# EAGLE design SCH (EAGLE 9.6.2)
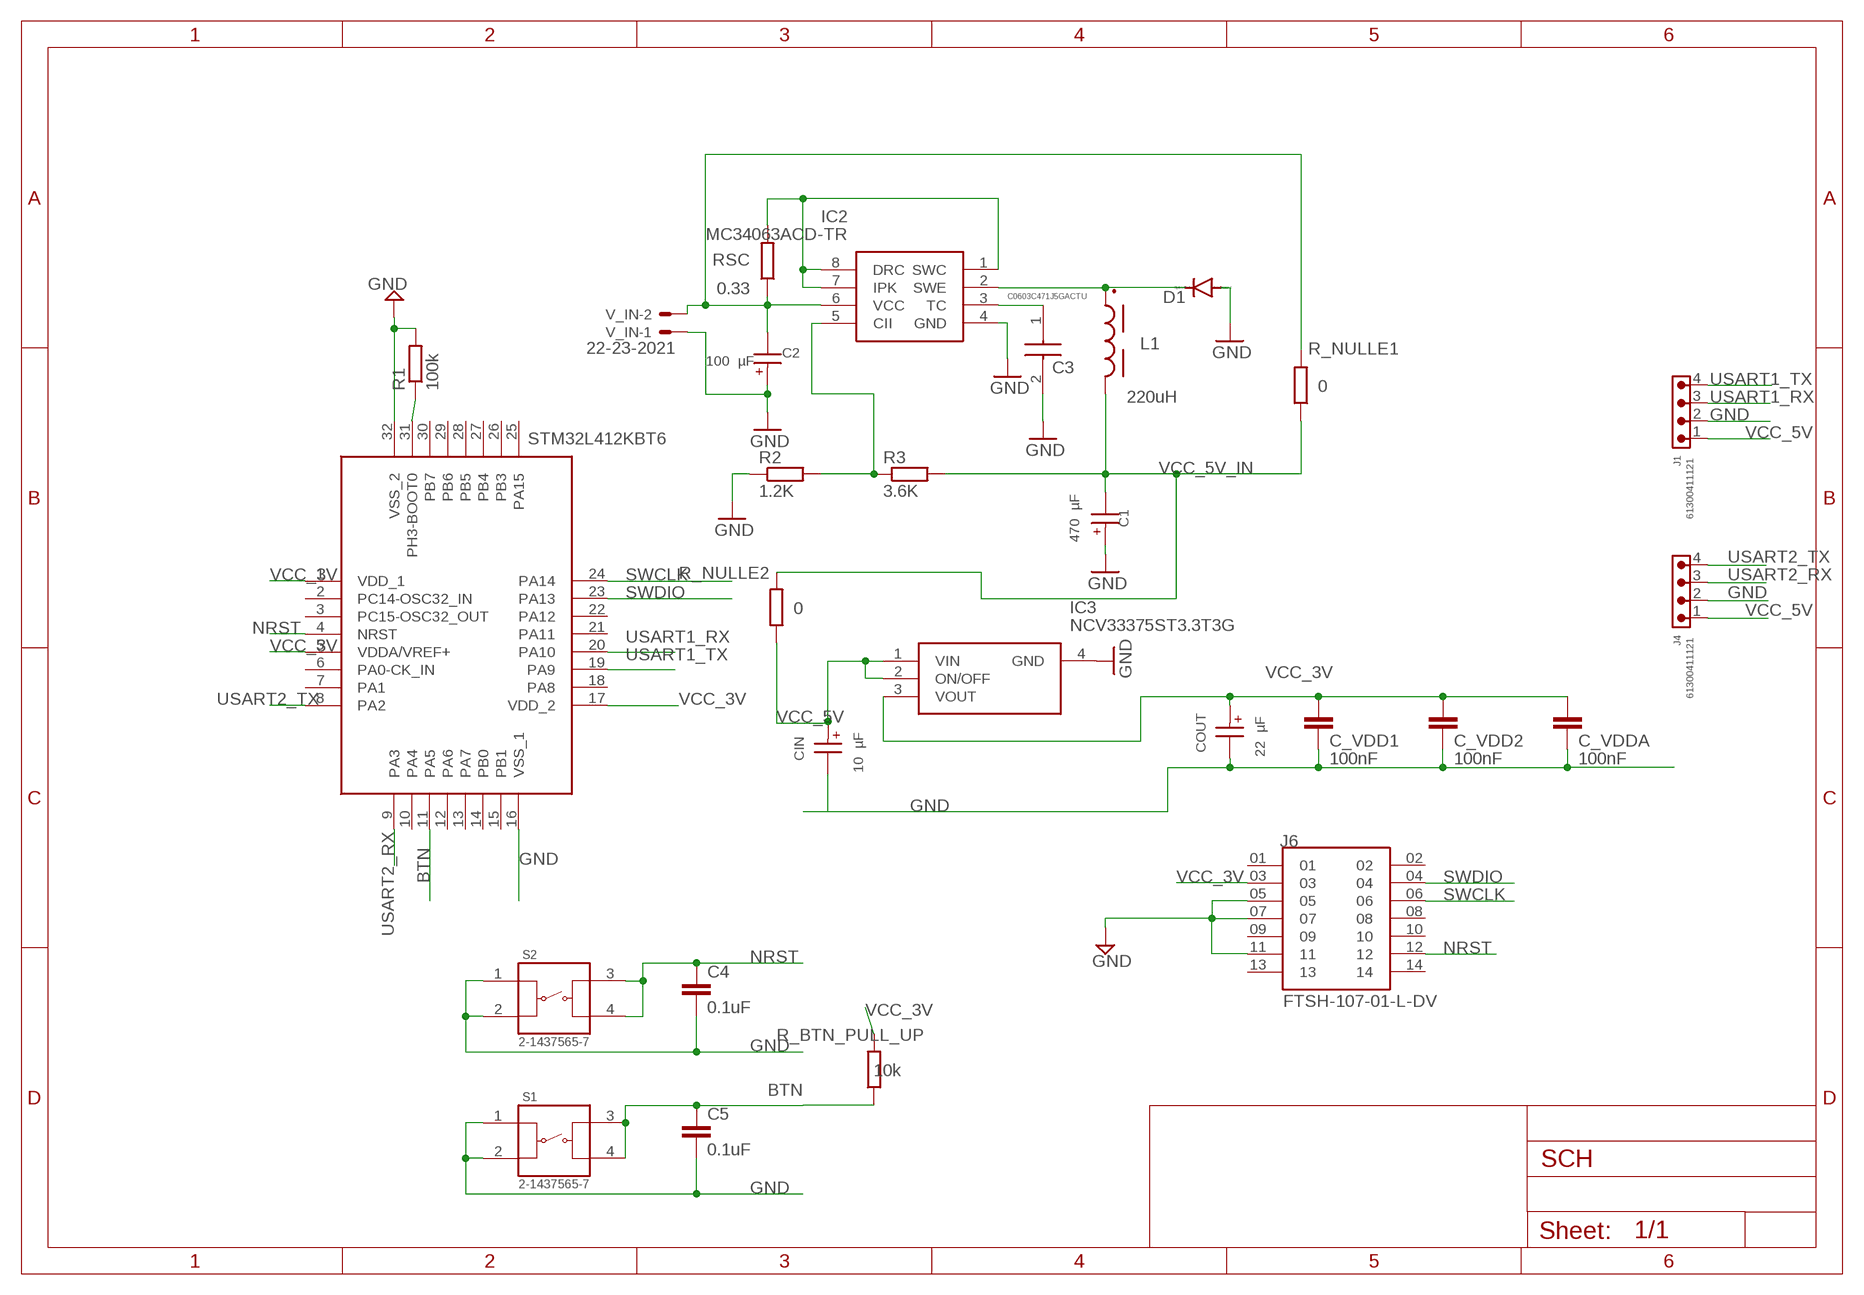
[diagram p0: schematic, sheet 1]

## Parts
C1  470 µF  WCAP-ASLL_8X10.5_865060353009  [WCAP-ASLL_8X10.5(DXL)]
C2  100 µF  WCAP-ASLL_6.3X7.7_865060445005  [WCAP-ASLL_6.3X7.7(DXL)]
C3  C0603C471J5GACTU  [C0603]
C4  0.1uF  C-EUC0603  [C0603]
C5  0.1uF  C-EUC0603  [C0603]
C_VDD1  100nF  C-EUC0603  [C0603]
C_VDD2  100nF  C-EUC0603  [C0603]
C_VDDA  100nF  C-EUC0603  [C0603]
CIN  10 µF  WCAP-ASLL_4X5.5_865060440001  [WCAP-ASLL_4X5.5(DXL)]
COUT  22 µF  WCAP-ASLL_5X5.5_865060442002  [WCAP-ASLL_5X5.5(DXL)]
D1  DIODE-DO214AC  [DO214AC]
IC1  STM32L412KBT6  [QFP80P900X900X160-32N]
IC2  MC34063ACD-TR  [SOIC127P600X175-8N]
IC3  NCV33375ST3.3T3G  [SOT230P700X175-4N]
J1  61300411121  6130XX11121_61300411121  [61300411121]
J4  61300411121  6130XX11121_61300411121  [61300411121]
J6  FTSH-107-01-L-DV  [SAMTEC_FTSH-107-01-L-DV]
L1  220uH  WE-PDA_1260_784771221  [WE-PDA_1260]
R1  100k  R-EU_R0603  [R0603]
R2  1.2K  R-EU_R0603  [R0603]
R3  3.6K  R-EU_R0603  [R0603]
R_BTN_PULL_UP  10k  R-EU_R0603  [R0603]
R_NULLE1  0  R-EU_R0603  [R0603]
R_NULLE2  0  R-EU_R0603  [R0603]
RSC  0.33  R-EU_R1206W  [R1206W]
S1  2-1437565-7  [SW_2-1437565-7]
S2  2-1437565-7  [SW_2-1437565-7]
V_IN  22-23-2021  [22-23-2021]

## Nets
BTN: C5.1 IC1.11(PA5) R_BTN_PULL_UP.1 S1.3 S1.4
GND: C1.1(+) C2.1(+) C3.2 C4.2 C5.2 C_VDD1.2 C_VDD2.2 C_VDDA.2 CIN.2(-) COUT.2(-) D1.A IC1.16(VSS_1) IC1.32(VSS_2) IC2.4(GND) IC3.4(GND) J1.2 J4.2 J6.05 J6.07 J6.11 R1.2 R2.1 S1.1 S1.2 S2.1 S2.2 V_IN.1
N$1: IC1.31(PH3-BOOT0) R1.1
N$2: IC2.1(SWC) IC2.7(IPK) IC2.8(DRC) RSC.2
N$3: IC2.5(CII) R2.2 R3.1
N$5: C3.1 IC2.3(TC)
N$6: D1.C IC2.2(SWE) L1.1
NRST: C4.1 IC1.4(NRST) J6.12 S2.3 S2.4
SWCLK: IC1.24(PA14) J6.06
SWDIO: IC1.23(PA13) J6.04
USART1_RX: IC1.20(PA10) J1.3
USART1_TX: IC1.19(PA9) J1.4
USART2_RX: IC1.9(PA3) J4.3
USART2_TX: IC1.8(PA2) J4.4
VCC_3V: C_VDD1.1 C_VDD2.1 C_VDDA.1 COUT.1(+) IC1.1(VDD_1) IC1.5(VDDA/VREF+) IC1.17(VDD_2) IC3.3(VOUT) J6.03 R_BTN_PULL_UP.2
VCC_5V: CIN.1(+) IC3.1(VIN) IC3.2(ON/OFF) J1.1 J4.1 R_NULLE2.1
VCC_5V_IN: C1.2(-) L1.2 R3.2 R_NULLE1.1 R_NULLE2.2
VCC_6V: C2.2(-) IC2.6(VCC) R_NULLE1.2 RSC.1 V_IN.2
Unconnected: IC1.2(PC14-OSC32_IN) IC1.3(PC15-OSC32_OUT) IC1.6(PA0-CK_IN) IC1.7(PA1) IC1.10(PA4) IC1.12(PA6) IC1.13(PA7) IC1.14(PB0) IC1.15(PB1) IC1.18(PA8) IC1.21(PA11) IC1.22(PA12) IC1.25(PA15) IC1.26(PB3) IC1.27(PB4) IC1.28(PB5) IC1.29(PB6) IC1.30(PB7) J6.01 J6.02 J6.08 J6.09 J6.10 J6.13 J6.14

## Library data of the parts
C1 = C1:WCAP-ASLL_8X10.5: WCAP-ASLL Aluminium Electrolytic Capacitors Low Impedance & Long Life +105 °C Characteristics Low impedance and long life product series Mounting style: V-Chip SMT Capacitance range: 1 µF ‒ 6800 µF Capacitance tolerance: ±20 % Voltage range (UR): 6.3 ‒ 450 V(DC) Operating temperature: -55 °C up to +105 °C for UR ≤ 100 V(DC) -40 °C up to +105 °C for UR > 100 V(DC) Endurance: 2000 ‒ 5000 h @ +105 °C Dimensions (DxL) in mm: 4.0 x 5.5 up to 16.0 x 17.0 Recommended soldering: Reflow soldering Applications Long life application & low impedance Input and output capacitor for switched-mode power supply Filtering Smoothing e.g. DC/DC converter, AC/DC converter, satellite receiver, control panel <https://www.we-online.com/catalog/media/o14724v209%20Family_WCAP-ASLL.jpg> Details see: https://www.we-online.com/catalog/en/WCAP-ASLL/ Updated by yingchun,Shan;2020-03-03 2020(C) Würth Elektronik; DATASHEET-URL: https://www.we-online.com/catalog/datasheet/865060353009.pdf; DF: 16%; DIAMETER: 8mm; I-LEAK: 75.2uA; I-RIPPLE: 600mA; L: 10.5mm; OPERATING-TEMPERATURE: -55 °C up to +105 °C; PART-NUMBER: 865060353009; TECHNICAL-REFERENCE: ASEE105471M016DVCTEE000; VR: 16V(DC); Z: 0.17Ohm
C2 = C2:WCAP-ASLL_6.3X7.7: WCAP-ASLL Aluminium Electrolytic Capacitors Low Impedance & Long Life +105 °C Characteristics Low impedance and long life product series Mounting style: V-Chip SMT Capacitance range: 1 µF ‒ 6800 µF Capacitance tolerance: ±20 % Voltage range (UR): 6.3 ‒ 450 V(DC) Operating temperature: -55 °C up to +105 °C for UR ≤ 100 V(DC) -40 °C up to +105 °C for UR > 100 V(DC) Endurance: 2000 ‒ 5000 h @ +105 °C Dimensions (DxL) in mm: 4.0 x 5.5 up to 16.0 x 17.0 Recommended soldering: Reflow soldering Applications Long life application & low impedance Input and output capacitor for switched-mode power supply Filtering Smoothing e.g. DC/DC converter, AC/DC converter, satellite receiver, control panel <https://www.we-online.com/catalog/media/o14724v209%20Family_WCAP-ASLL.jpg> Details see: https://www.we-online.com/catalog/en/WCAP-ASLL/ Updated by yingchun,Shan;2020-03-03 2020(C) Würth Elektronik; DATASHEET-URL: https://www.we-online.com/catalog/datasheet/865060445005.pdf; DF: 14%; DIAMETER: 6.3mm; I-LEAK: 25uA; I-RIPPLE: 300mA; L: 7.7mm; OPERATING-TEMPERATURE: -55 °C up to +105 °C; PART-NUMBER: 865060445005; TECHNICAL-REFERENCE: ASED077101M025DVCTCB000; VR: 25V(DC); Z: 0.36Ohm
C3 = C3:C0603C471J5GACTU: SMD Comm C0G, Ceramic, 470 pF, 5%, 50 VDC, 125 VDC, 125?C, -55?C, C0G, SMD, MLCC, Ultra-Stable, Low Loss, Class I, 0.1 % , 100 GOhms, 3.7 mg, 0603, 1.6mm, 0.8mm, 0.8mm, 0.7mm, 0.35mm, 4000, 78 Weeks, 120 Source: Datasheet <https://content.kemet.com/datasheets/KEM_C1003_C0G_SMD.pdf>; ARROW_PART_NUMBER: C0603C471J5GACTU; ARROW_PRICE-STOCK: https://www.arrow.com/en/products/c0603c471j5gactu/kemet-corporation?region=nac; DESCRIPTION: SMD Comm C0G, Ceramic, 470 pF, 5%, 50 VDC, 125 VDC, 125?C, -55?C, C0G, SMD, MLCC, Ultra-Stable, Low Loss, Class I, 0.1 % , 100 GOhms, 3.7 mg, 0603, 1.6mm, 0.8mm, 0.8mm, 0.7mm, 0.35mm, 4000, 78 Weeks, 120; HEIGHT: 0.87mm; MANUFACTURER_NAME: KEMET; MANUFACTURER_PART_NUMBER: C0603C471J5GACTU; MOUSER_PART_NUMBER: 80-C0603C471J5G; MOUSER_PRICE-STOCK: https://www.mouser.co.uk/ProductDetail/KEMET/C0603C471J5GACTU?qs=6Zy9Yzz7FWCvDjERNKhvPg%3D%3D
C4 C5 C_VDD1 C_VDD2 C_VDDA = rcl:C-EU: CAPACITOR, European symbol; SPICEPREFIX: C
CIN = Cin:WCAP-ASLL_4X5.5: WCAP-ASLL Aluminium Electrolytic Capacitors Low Impedance & Long Life +105 °C Characteristics Low impedance and long life product series Mounting style: V-Chip SMT Capacitance range: 1 µF ‒ 6800 µF Capacitance tolerance: ±20 % Voltage range (UR): 6.3 ‒ 450 V(DC) Operating temperature: -55 °C up to +105 °C for UR ≤ 100 V(DC) -40 °C up to +105 °C for UR > 100 V(DC) Endurance: 2000 ‒ 5000 h @ +105 °C Dimensions (DxL) in mm: 4.0 x 5.5 up to 16.0 x 17.0 Recommended soldering: Reflow soldering Applications Long life application & low impedance Input and output capacitor for switched-mode power supply Filtering Smoothing e.g. DC/DC converter, AC/DC converter, satellite receiver, control panel <https://www.we-online.com/catalog/media/o14724v209%20Family_WCAP-ASLL.jpg> Details see: https://www.we-online.com/catalog/en/WCAP-ASLL/ Updated by yingchun,Shan;2020-03-03 2020(C) Würth Elektronik; DATASHEET-URL: https://www.we-online.com/catalog/datasheet/865060440001.pdf; DF: 14%; DIAMETER: 4mm; I-LEAK: 3uA; I-RIPPLE: 90mA; L: 5.5mm; OPERATING-TEMPERATURE: -55 °C up to +105 °C; PART-NUMBER: 865060440001; TECHNICAL-REFERENCE: ASEB055100M025DVCTAB000; VR: 25V(DC); Z: 1.35Ohm
COUT = Cout:WCAP-ASLL_5X5.5: WCAP-ASLL Aluminium Electrolytic Capacitors Low Impedance & Long Life +105 °C Characteristics Low impedance and long life product series Mounting style: V-Chip SMT Capacitance range: 1 µF ‒ 6800 µF Capacitance tolerance: ±20 % Voltage range (UR): 6.3 ‒ 450 V(DC) Operating temperature: -55 °C up to +105 °C for UR ≤ 100 V(DC) -40 °C up to +105 °C for UR > 100 V(DC) Endurance: 2000 ‒ 5000 h @ +105 °C Dimensions (DxL) in mm: 4.0 x 5.5 up to 16.0 x 17.0 Recommended soldering: Reflow soldering Applications Long life application & low impedance Input and output capacitor for switched-mode power supply Filtering Smoothing e.g. DC/DC converter, AC/DC converter, satellite receiver, control panel <https://www.we-online.com/catalog/media/o14724v209%20Family_WCAP-ASLL.jpg> Details see: https://www.we-online.com/catalog/en/WCAP-ASLL/ Updated by yingchun,Shan;2020-03-03 2020(C) Würth Elektronik; DATASHEET-URL: https://www.we-online.com/catalog/datasheet/865060442002.pdf; DF: 14%; DIAMETER: 5mm; I-LEAK: 5.5uA; I-RIPPLE: 150mA; L: 5.5mm; OPERATING-TEMPERATURE: -55 °C up to +105 °C; PART-NUMBER: 865060442002; TECHNICAL-REFERENCE: ASEC055220M025DVCTBB000; VR: 25V(DC); Z: 0.8Ohm
D1 = diode:DIODE-: DIODE
IC1 = STM32_librairy:STM32L412KBT6: ARM Microcontrollers - MCU Ultra-low-power Arm Cortex -M4 32-bit MCU+FPU, 100DMIPS up to 128KB Flash, 40KB SRAM, analog, ext. SMPS Source: Datasheet; DESCRIPTION: ARM Microcontrollers - MCU Ultra-low-power Arm Cortex -M4 32-bit MCU+FPU, 100DMIPS up to 128KB Flash, 40KB SRAM, analog, ext. SMPS; HEIGHT: 1.6mm; MANUFACTURER_NAME: STMicroelectronics; MANUFACTURER_PART_NUMBER: STM32L412KBT6; MOUSER_PART_NUMBER: 511-STM32L412KBT6; MOUSER_PRICE-STOCK: https://www.mouser.co.uk/ProductDetail/STMicroelectronics/STM32L412KBT6?qs=%252BEew9%252B0nqrD6o08jV%2F00TA%3D%3D
IC2 = SamacSys_Parts:MC34063ACD-TR: MC34063ACD-TR, DC-DC Controller, 40 V, 8-Pin, SOIC Source: Datasheet <http://www.st.com/st-web-ui/static/active/en/resource/technical/document/datasheet/CD00001232.pdf>; DESCRIPTION: MC34063ACD-TR, DC-DC Controller, 40 V, 8-Pin, SOIC; HEIGHT: 1.75mm; MANUFACTURER_NAME: STMicroelectronics; MANUFACTURER_PART_NUMBER: MC34063ACD-TR; MOUSER_PART_NUMBER: 511-MC34063ACD-TR; MOUSER_PRICE-STOCK: https://www.mouser.co.uk/ProductDetail/STMicroelectronics/MC34063ACD-TR?qs=zDcCjb1ShEnlEhOFqqejBw%3D%3D
IC3 = SamacSys_Parts:NCV33375ST3.3T3G: ON SEMICONDUCTOR - NCV33375ST3.3T3G - Fixed LDO Voltage Regulator, 4.3V to 13V, 260mV Dropout, 3.3Vout, 300mAout, SOT-223-4 Source: Datasheet <http://www.onsemi.com/pub/Collateral/MC33375-D.PDF>; DESCRIPTION: ON SEMICONDUCTOR - NCV33375ST3.3T3G - Fixed LDO Voltage Regulator, 4.3V to 13V, 260mV Dropout, 3.3Vout, 300mAout, SOT-223-4; HEIGHT: 1.75mm; MANUFACTURER_NAME: onsemi; MANUFACTURER_PART_NUMBER: NCV33375ST3.3T3G; MOUSER_PART_NUMBER: 863-NCV33375ST3.3T3G; MOUSER_PRICE-STOCK: https://www.mouser.co.uk/ProductDetail/ON-Semiconductor/NCV33375ST33T3G?qs=Pqj8oIac8rWOl%252BM3OwXrOg%3D%3D
J1 J4 = Eagle_WR-PHD (rev21a):6130XX11121_61300411121: WR-PHD 2.54 mm THT Pin Header ARTICLE PROPERTIES: Pins:1;​ 2;​ 3;​ 4;​ 5;​ 6;​ 7;​ 8;​ 9;​ 10;​ 12;​ 13;​ 14;​ 15;​ 16;​ 18;​ 20;​ 22;​ 24;​ 25;​ 32;​ 36;​ 40 KIND PROPERTIES: Pitch：2.54 mm Quality Class:3 as per CECC 75 301-802 Rows：Single Gender：Pin Header Type：Straight MATERIAL PROPERTIES: Insulator Material :PBT Insulator Flammability Rating:UL94 V-0 Contact Material:Copper Alloy Contact Plating:Gold Contact Type:Stamped GENERAL INFORMATION Operating Temperature:-40 up to +105 °C Compliance:RoHS ELECTRICAL PROPERTIES: Rated Current:3 A IR 1:3 A Withstanding Voltage:500 V (AC) Contact Resistance:20 mΩ RISO:1000 MΩ CERTIFICATION UL Approval:E323964 PACKAGING PROPERTIES Packaging:Bag <https://katalog.we-online.com/media/images/v2/o33211v209%20Family_BTB_PHD_6130xx11121.jpg> Details see: https://katalog.we-online.com/en/em/PHD_2_54_THT_PIN_HEADER_6130XX11121 Updated by Yingchun,Shan 2019-10-16 2019 (C) Würth Elektronik; DATASHEET-URL: https://www.we-online.com/catalog/datasheet/61300411121.pdf; GENDER: Pin Header; IR: 3A; MOUNT: THT; PACKAGING: Bag; PART-NUMBER: 61300411121; PINS: 4; PITCH: 2.54mm; ROWS: Single; TYPE: Straight
J6 = FTSH-107-01-L-DV:FTSH-107-01-L-DV; MANUFACTURER: Samtec; PARTREV: R; STANDARD: Manufacturer Recommendations
L1 = L:WE-PDA_1260: WE-PDA SMD Shielded Power Inductor Characteristics Magnetically shielded version which results in a low leakage field High storage capacity High Saturation currents up to 23 A Very low self-losses at high switching frequency's Wide inductance spectrum available at all sizes Operating Temperature -40 °C up to +125 °C Core Material: NiZn Wire connection: welding technology Applications Multimedia applications Switching regulators with low operating voltages Integrated DC/DC-converter Perfect suitable for switching regulators with extremely high efficiency (> 86 %) Plastic base: Because of the one piece construction these are more suitable for high vibration or shock applications <https://www.we-online.com/catalog/media/o55118v209%20Family_WE-PDA.jpg> Details see: https://www.we-online.com/katalog/en/WE-PDA Updated by Ella Wu 2020-03-18 2020(C) Wurth Elektronik; DATASHEET-URL: https://www.we-online.com/catalog/datasheet/784771221.pdf; FRES: 3.9MHz; IR: 0.99A; ISAT: 1.1A; MOUNT: SMT; PART-NUMBER: 784771221; RDC-MAX: 348mOhm; RDC-TYP: 290mOhm
R1-R3 R_BTN_PULL_UP R_NULLE1 R_NULLE2 RSC = rcl:R-EU_: RESISTOR, European symbol; SPICEPREFIX: R
S1 S2 = 2-1437565-7:2-1437565-7: FSM2JSMA=SMT,TACTILE,PB SWITCH Check availability <https://pricing.snapeda.com/parts/FSM2JSMA/TE%20Connectivity/view-part?ref=eda>; AVAILABILITY: In Stock; COMMENT: 2-1437565-7; CONFIGURATION_POLE-THROW: Single Pole - Single Throw; CONTACT_CURRENT_RATING: 50 mA; DESCRIPTION: Tactile Switch SPST-NO Top Actuated Surface Mount; MF: TE Connectivity; MP: FSM2JSMA; PACKAGE: None; PRICE: None; PURCHASE-URL: https://pricing.snapeda.com/search/part/FSM2JSMA/?ref=eda
V_IN = con-molex:22-23-2021: .100" (2.54mm) Center Header - 2 Pin; MF: MOLEX; MPN: 22-23-2021; OC_FARNELL: 1462926; OC_NEWARK: 25C3832

## Board
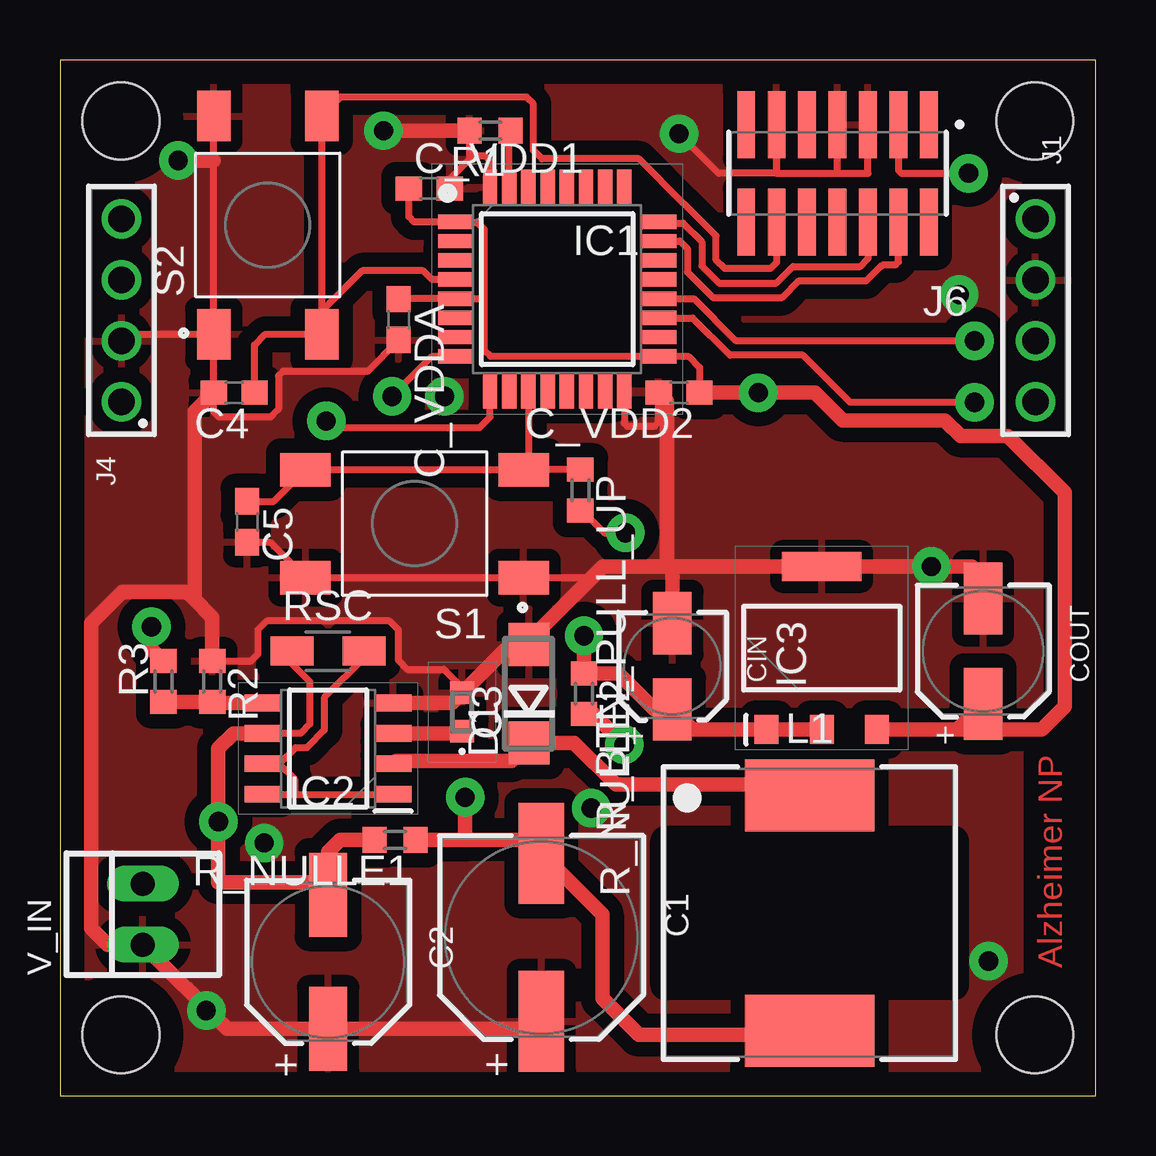
[diagram p1: board, top side]
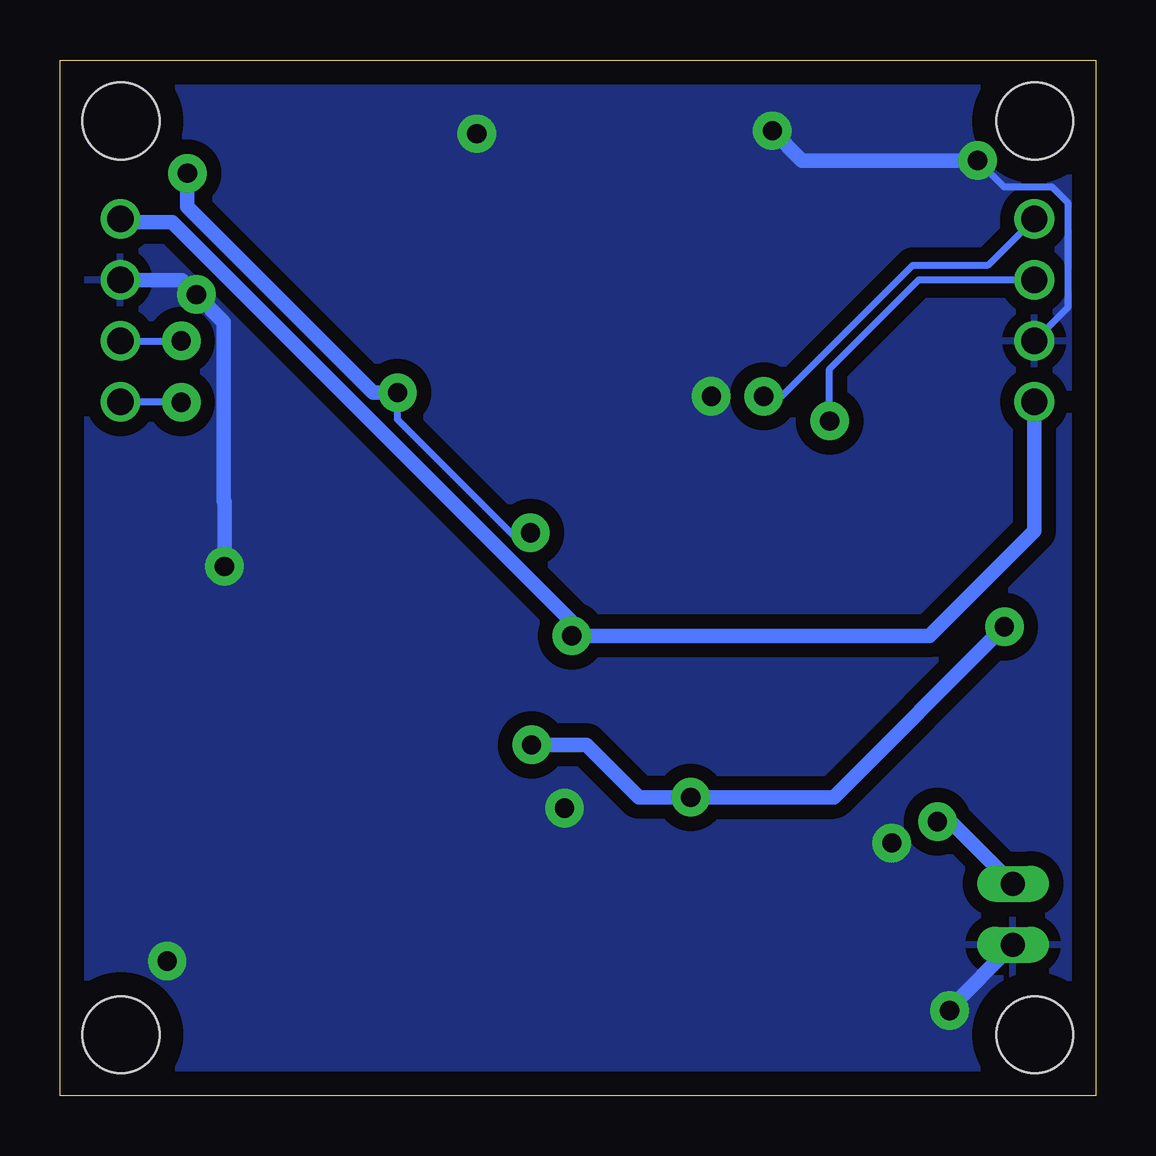
[diagram p2: board, bottom side, seen from below]

Size 43.18 x 43.18 mm. Coordinates in mm from the lower left corner, seen from the top.
Outline: 0,0 43.18,0 43.18,43.18 0,43.18 0,0
Copper layers (1*16): Top 0.035mm / dielectric 1.5mm / Bottom 0.035mm
Design rules "ENSEA_2022_04_08 *": minimum track width 0.3mm, minimum drill 0.5mm, track to track 0.3mm, track to pad 0.3mm, pad to pad 0.3mm, via to via 0.3mm, smd to smd 0.3mm, copper to edge 1mm, drill to drill 0.4mm, minimum pad ring 0.2mm, minimum via ring 0.2mm, stop-mask expansion 4mil, vias tented up to drill 0mil, thermal gap 0.5mm
Holes 3.2 mm at 2.54,2.54 40.64,2.54 40.64,40.64 2.54,40.64

### Footprints (pad centres in the part's own frame; a part is rotated, then mirrored left to right if it is on the bottom)
WCAP-ASLL_8X10.5(DXL) = smd 4.2 x 1.9: 1 3.5,0; 2 -3.5,0
WCAP-ASLL_6.3X7.7(DXL) = smd 3.5 x 1.6: 1 2.8,0; 2 -2.8,0
C0603 = smd 0.95 x 1: 1 -0.8,0; 2 0.8,0
C0603' = smd 1.1 x 1: 1 -0.85,0; 2 0.85,0
WCAP-ASLL_4X5.5(DXL) = smd 2.6 x 1.6: 1 1.8,0; 2 -1.8,0
WCAP-ASLL_5X5.5(DXL) = smd 3 x 1.6: 1 2.2,0; 2 -2.2,0
DO214AC = smd 1.8 x 1.7: A 2.05,0; C -2.05,0
QFP80P900X900X160-32N = smd 1.475 x 0.6: 1 -4.238,2.8; 2 -4.238,2; 3 -4.238,1.2; 4 -4.238,0.4; 5 -4.238,-0.4; 6 -4.238,-1.2; 7 -4.238,-2; 8 -4.238,-2.8; 17 4.238,-2.8; 18 4.238,-2; 19 4.238,-1.2; 20 4.238,-0.4; 21 4.238,0.4; 22 4.238,1.2; 23 4.238,2; 24 4.238,2.8 | smd 0.6 x 1.475: 9 -2.8,-4.238; 10 -2,-4.238; 11 -1.2,-4.238; 12 -0.4,-4.238; 13 0.4,-4.238; 14 1.2,-4.238; 15 2,-4.238; 16 2.8,-4.238; 25 2.8,4.238; 26 2,4.238; 27 1.2,4.238; 28 0.4,4.238; 29 -0.4,4.238; 30 -1.2,4.238; 31 -2,4.238; 32 -2.8,4.238
SOIC127P600X175-8N = smd 1.525 x 0.7: 1 -2.712,1.905; 2 -2.712,0.635; 3 -2.712,-0.635; 4 -2.712,-1.905; 5 2.712,-1.905; 6 2.712,-0.635; 7 2.712,0.635; 8 2.712,1.905
SOT230P700X175-4N = smd 1.2 x 1: 1 -3.4,2.3; 2 -3.4,0; 3 -3.4,-2.3 | smd 1.2 x 3.3: 4 3.4,0
61300411121 = drill 1.1: 1 -3.81,0; 2 -1.27,0; 3 1.27,0; 4 3.81,0
SAMTEC_FTSH-107-01-L-DV = smd 0.74 x 2.79: 01 -3.81,-2.035; 02 -3.81,2.035; 03 -2.54,-2.035; 04 -2.54,2.035; 05 -1.27,-2.035; 06 -1.27,2.035; 07 0,-2.035; 08 0,2.035; 09 1.27,-2.035; 10 1.27,2.035; 11 2.54,-2.035; 12 2.54,2.035; 13 3.81,-2.035; 14 3.81,2.035
WE-PDA_1260 = smd 5.4 x 3: 1 0,4.9; 2 0,-4.9
R0603 = smd 1 x 1.1: 1 -0.85,0; 2 0.85,0
R1206W = smd 1.8 x 1.2: 1 -1.499,0; 2 1.499,0
SW_2-1437565-7 = smd 2.1 x 1.4: 1 -4.55,2.25; 2 4.55,2.25; 3 -4.55,-2.25; 4 4.55,-2.25
22-23-2021 = drill 1 long: 1 -1.27,0; 2 1.27,0

### Placement (x,y rotation side)
C1  20.07,6.6 270 top
C2  11.18,5.59 270 top
C3  16.76,16 90 top
C4  0.1uF  [C0603']  7.26,29.31 180 top
C5  0.1uF  [C0603']  7.8,23.93 270 top
C_VDD1  100nF  [C0603']  15.39,37.82 0 top
C_VDD2  100nF  [C0603']  25.81,29.31 180 top
C_VDDA  100nF  [C0603']  14.12,32.36 270 top
CIN  25.53,17.91 270 top
COUT  38.48,18.54 270 top
D1  19.56,16.76 90 top
IC1  20.73,33.63 0 top
IC2  11.18,14.48 180 top
IC3  31.75,18.67 90 top
J1  40.67,32.74 270 top
J4  2.57,32.74 90 top
J6  32.41,38.46 180 top
L1  31.24,7.62 0 top
R1  17.93,40.23 180 top
R2  6.35,17.27 270 top
R3  4.32,17.27 90 top
R_BTN_PULL_UP  21.69,25.25 270 top
R_NULLE1  13.97,10.67 180 top
R_NULLE2  21.84,16.76 270 top
RSC  11.18,18.54 0 top
S1  14.78,23.85 180 top
S2  8.66,36.3 90 top
V_IN  3.45,7.57 90 top

### Tracks (layer width: path | path; a pad name or v marks a point on that pad's centre or on a via)
BTN
  Top 0.3: C5.1 8.91,24.78 S1.4 S1.3 | IC1.11 19.53,26.29 S1.3 | S1.3 R_BTN_PULL_UP.1
GND  (via drill 0.8 pad 1.6)
  Top 0.3: R2.1 7.96,18.12 8.26,18.41 8.26,19.43 8.64,19.81 13.72,19.81 14.1,19.43 14.1,18.16 14.48,17.78 16,17.78 16.76,17.02 C3.2 | S2.1 C4.2 6.41,28.51 6.63,28.3 8.79,28.3 9.11,28.62 9.11,30.02 9.3,30.2 12.81,30.2 C_VDDA.2 | J4.2 2.84,31.75 S2.1 | R1.2 17.08,39.04 | IC1.16 23.53,28.04 23.65,27.91 24.79,27.91 24.96,28.08 C_VDD2.2 | S2.1 6.41,38.99 S2.2 | J6.11 29.87,38.46 | 29.87,38.46 32.41,38.46 | 32.41,38.46 J6.07 | 32.41,38.46 33.68,38.46 J6.05 | 29.87,38.46 27.46,38.46 v25.81,40.11 | C5.2 8.76,23.08 S1.2 S1.1 22.34,21.6 22.81,22.07 | C_VDD1.2 16.24,38.2 17.08,39.04 | IC1.32 17.93,38.97 17.73,39.17 17.21,39.17 17.08,39.04
  Top 0.6: C1.1 19.75,2.79 C2.1 6.97,2.79 V_IN.1 1.99,6.3 1.3,6.99 1.3,19.71 2.59,21.01 5.28,21.01 5.59,20.7 | IC2.4 16.34,16.38 C3.2 18.78,18.81 D1.A 19.56,18.99 22.64,22.07 22.81,22.07 25.31,22.07 25.31,28.96 C_VDD2.2 | 5.59,20.7 6.35,19.94 R2.1 | 5.59,20.7 5.61,20.7 5.61,28.52 C4.2 | 25.62,22.07 IC3.4 v36.32,22.07 38,22.07 38.48,21.59 COUT.2 | 25.62,22.07 25.53,21.97 CIN.2 | 24.89,22.07 25.62,22.07 | R1.2 v13.49,40.23 | 6.41,38.99 v4.93,38.99
  Bottom 0.3: J4.2 1.15,32.89 1.15,37.21 1.83,37.89 3.83,37.89 v4.93,38.99
  Bottom 0.6: v36.32,22.07 36.32,24.76 36.35,24.79 36.35,32.26 v37.49,33.4 38.1,34.01 J1.2 | v4.93,38.99 12.24,38.99 v13.49,40.23 | V_IN.1 6.1,3.66 v6.1,3.56
  other vias: 38.71,5.61 8.51,10.54 22.15,11.99 16.03,29.16
  pour Top (isolate 0.6): 0,0 43.18,0 43.18,43.18 0,43.18
  pour Bottom (isolate 0.6): 0,0 43.18,0 43.18,43.18 0,43.18
N$1
  Top 0.3: IC1.31 18.73,40.18 R1.1
N$2
  Top 0.3: RSC.2 12.68,18.26 11.01,16.6 11.01,15.24 10.28,14.51 9.81,14.51 9.14,13.84 | IC2.8 9.78,12.57 | 9.78,12.57 IC2.1 | IC2.7 9.14,13.84 | 9.78,12.57 9.78,13.21 9.14,13.84
N$3
  Top 0.6: IC2.5 6.39,16.38 R2.2 R3.1
N$5
  Top 0.6: IC2.3 16.68,15.11 C3.1
N$6
  Top 0.6: IC2.2 14.02,13.97 18.81,13.97 D1.C 21.43,14.71 23.17,12.98 30.79,12.98 L1.1
NRST
  Top 0.3: C4.1 8.11,31.3 8.56,31.75 S2.3 | IC1.4 15.5,34.03 15.14,34.39 12.6,34.39 10.91,32.7 S2.3 | S2.3 S2.4 11.7,41.63 19.46,41.63 19.73,41.35 19.73,39.41 20.09,39.05 24.14,39.05 26.02,37.18 26.03,37.18 27.35,35.85 27.35,34.84 27.71,34.48 29.62,34.48 29.87,34.74 J6.12
SWCLK
  Top 0.3: IC1.24 25.01,36.38 25.98,36.38 26.75,35.6 26.75,34.59 27.46,33.88 29.86,33.88 30.56,34.58 33.36,34.58 33.68,34.9 J6.06
SWDIO
  Top 0.3: IC1.23 25.84,35.63 26.15,35.32 26.15,34.35 27.21,33.28 30.11,33.28 30.8,33.98 33.6,33.98 34.2,34.58 34.24,34.58 34.31,34.65 34.82,34.65 34.95,34.77 J6.04
USART1_RX  (via drill 0.8 pad 1.6)
  Top 0.3: IC1.20 26.42,33.23 28.18,31.47 v38.12,31.47
  Bottom 0.3: J1.3 v38.12,31.47
USART1_TX  (via drill 0.8 pad 1.6)
  Top 0.3: IC1.19 26.37,32.43 27.93,30.87 30.98,30.87 32.94,28.91 v38.12,28.91
  Bottom 0.3: v38.12,28.91 38.15,28.93 J1.4
USART2_RX  (via drill 0.8 pad 1.6)
  Top 0.3: v11.1,28.13 11.39,27.84 17.48,27.84 17.93,28.3 IC1.9
  Bottom 0.3: J4.3 7.39,34.01 11.1,30.3 v11.1,28.13
USART2_TX  (via drill 0.8 pad 1.6)
  Top 0.3: v13.84,29.16 15.51,30.83 IC1.8
  Bottom 0.3: J4.4 4.5,34.61 7.64,34.61 13.09,29.16 v13.84,29.16
VCC_3V  (via drill 0.8 pad 1.6)
  Top 0.3: C_VDD1.1 14.54,36.64 14.75,36.43 IC1.1 17.37,36.43 17.68,36.12 17.68,33.25 | C_VDDA.1 14.14,33.23 IC1.5 17.66,33.23 17.68,33.25 | C_VDD2.1 26.66,30.37 26.19,30.83 IC1.17 17.94,30.83 17.68,31.09 17.68,33.25 | J6.03 34.95,38.58 35.08,38.46 v37.87,38.46 | R_BTN_PULL_UP.2 21.77,24.4 22.7,23.47 v23.57,23.47
  Top 0.6: IC3.3 37.41,15.27 | 37.41,15.27 COUT.1 | 37.41,15.27 40.92,15.27 41.88,16.23 41.88,25.15 39.52,27.5 37.55,27.5 36.9,28.16 32.63,28.16 31.48,29.31 v29.11,29.31 C_VDD2.1
  Bottom 0.3: v23.57,23.47 23.8,23.24 24.16,23.24 29.11,28.19 v29.11,29.31
  Bottom 0.6: v29.11,29.31 30.12,29.31 37.87,37.06 v37.87,38.46
VCC_5V  (via drill 0.8 pad 1.6)
  Top 0.6: IC3.2 IC3.1 26.36,15.27 CIN.1 24.79,16.11 23.28,17.61 R_NULLE2.1 v21.84,19.18
  Bottom 0.6: J4.1 2.56,23.55 6.93,19.18 v21.84,19.18 21.84,19.76 38.51,36.42 40.54,36.42 J1.1
VCC_5V_IN  (via drill 0.8 pad 1.6)
  Top 0.6: R_NULLE1.1 16.89,10.67 | 16.89,10.67 19.5,10.67 C1.2 22.61,7.56 22.61,4.06 24.13,2.54 31.06,2.54 L1.2 | 16.89,10.67 v16.89,12.45 | v3.81,19.56 3.81,18.63 R3.2 | v23.52,14.63 22.24,15.91 R_NULLE2.2
  Bottom 0.6: v3.81,19.56 10.92,12.45 v16.89,12.45 19.05,12.45 21.23,14.63 v23.52,14.63
VCC_6V  (via drill 0.8 pad 1.6)
  Top 0.3: RSC.1 9.68,18.01 10.41,17.27 10.41,15.49 10.03,15.11 IC2.6
  Top 0.6: IC2.6 7.24,15.11 6.6,14.48 v6.6,11.43 6.6,8.89 10.67,8.89 C2.2 11.18,10.16 11.68,10.67 R_NULLE1.2
  Bottom 0.6: V_IN.2 6.04,11.43 v6.6,11.43

### Text on the board
Top: Alzheimer NP